# Altium schematic sheet temp.SchDoc
size A4
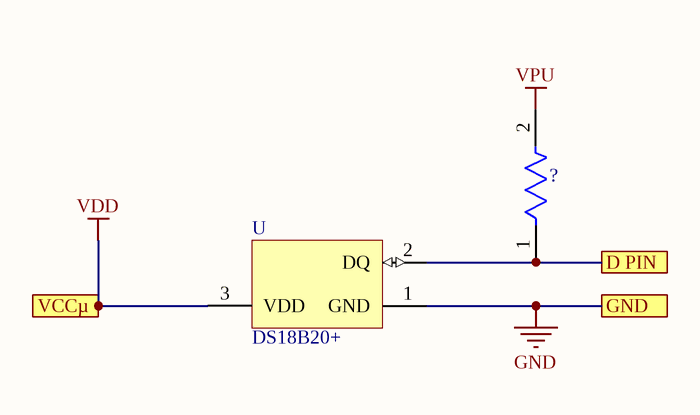
[diagram p0: temp.SchDoc]

## Parts
?  ERA3AEB302V  [FP-ERA3A-IPC_C]  (value not drawn)
U  DS18B20+  [Q3+1]

## Ports
D PIN, GND, VCCµ

## Nets
GND: U.1(GND) ; port GND
VDD: U.3(VDD) ; port VCCµ
VPU: ?.2
D PIN: ?.1 U.2(DQ) ; port D PIN

## Library data of the parts
? = CMP-2000-00026-2: RES SMD 4.7K OHM 0.1% 1/10W 0603; Voltage Rating: 75V; Resistance: 3kR; Power Rating: 100mW; Temperature Coefficient: 25ppm/°C; Series: ERA-3A; Min Operating Temperature: -55°C; Case Code (Imperial): 0603; Termination: SMD/SMT; Mount: Surface Mount; Package Quantity: 1; Features: Automotive AEC-Q200; Case/Package: 0603; Resistance Tolerance: 0.1%; Height: 0.45mm; Length: 1.6mm; Size Code: 0603; Packaging: Tape and Reel; Number of Terminations: 2; Max Operating Temperature: 155°C; Lead Free: Lead Free; Max Power Dissipation: 100mW; REACH SVHC: No SVHC; Depth: 0.8mm; Resistor Type: Thin Film; Case Code (Metric): 1608; Voltage Rating (DC): 75V; Width: 0.8mm; Construction: Rectangular; Technology: THIN FILM; Number of Pins: 2; Military Standard: Not; Radiation Hardening: No; RoHS Compliant: Yes; Contact Plating: Tin
U = CMP-0253-00003-1: Programmable Resolution Digital Thermometer, 1-Wire Interface, ±0.5°C Accuracy, 3-Pin TO92, -55°C to +125°C, Pb-Free; ComponentLink2URL: http://datasheets.maxim-ic.com/en/ds/DS18B20.pdf; PackageReference: Q3+1; ComponentLink1Description: Manufacturer URL; PackageDescription: TO-92 Package, Body Dia. 4.7mm; Leads 0.51 x 0.51 mm (max), Pb-Free; DatasheetVersion: 2007; Code_JEDEC: TO-226-AA; ComponentLink1URL: http://www.maxim-ic.com; PackageVersion: revB, 2009; ComponentLink2Description: Datasheet